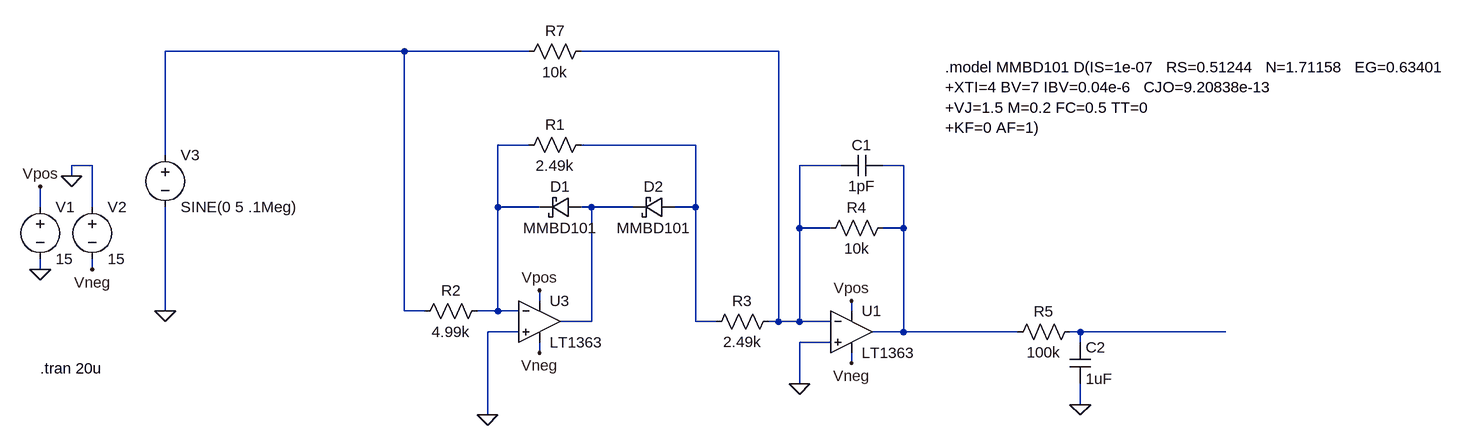
[diagram p0: schematic full wave rectifer LT6275.asc]
full wave rectifer LT6275.asc, the LTspice schematic file:
Version 4
SHEET 1 1204 916
WIRE -512 128 -880 128
WIRE -320 128 -512 128
WIRE 64 128 -240 128
WIRE -320 272 -368 272
WIRE -64 272 -240 272
WIRE -880 288 -880 128
WIRE -992 304 -1024 304
WIRE 160 304 96 304
WIRE 256 304 224 304
WIRE -1024 320 -1024 304
WIRE -1072 368 -1072 336
WIRE -992 368 -992 304
WIRE -368 368 -368 272
WIRE -304 368 -368 368
WIRE -224 368 -240 368
WIRE -160 368 -224 368
WIRE -64 368 -64 272
WIRE -64 368 -96 368
WIRE 96 400 96 304
WIRE 144 400 96 400
WIRE 256 400 256 304
WIRE 256 400 224 400
WIRE -1072 464 -1072 448
WIRE -992 464 -992 448
WIRE -304 512 -304 496
WIRE -880 528 -880 368
WIRE -512 528 -512 128
WIRE -480 528 -512 528
WIRE -368 528 -368 368
WIRE -368 528 -400 528
WIRE -336 528 -368 528
WIRE 176 528 176 512
WIRE -224 544 -224 368
WIRE -224 544 -272 544
WIRE -64 544 -64 368
WIRE -32 544 -64 544
WIRE 64 544 64 128
WIRE 64 544 48 544
WIRE 96 544 96 400
WIRE 96 544 64 544
WIRE 144 544 96 544
WIRE -336 560 -384 560
WIRE 256 560 256 400
WIRE 256 560 208 560
WIRE 432 560 256 560
WIRE 528 560 512 560
WIRE 752 560 528 560
WIRE 144 576 96 576
WIRE 528 576 528 560
WIRE -304 592 -304 576
WIRE 176 608 176 592
WIRE 96 640 96 576
WIRE 528 672 528 640
WIRE -384 688 -384 560
FLAG -1072 464 0
FLAG -1072 336 Vpos
FLAG -1024 320 0
FLAG -992 464 Vneg
FLAG -880 528 0
FLAG -384 688 0
FLAG 96 640 0
FLAG 528 672 0
FLAG -304 496 Vpos
FLAG -304 592 Vneg
FLAG 176 512 Vpos
FLAG 176 608 Vneg
SYMBOL voltage -1072 352 R0
WINDOW 123 0 0 Left 2
WINDOW 39 0 0 Left 2
SYMATTR InstName V1
SYMATTR Value 15
SYMBOL voltage -992 352 R0
WINDOW 123 0 0 Left 2
WINDOW 39 0 0 Left 2
SYMATTR InstName V2
SYMATTR Value 15
SYMBOL res -336 288 R270
WINDOW 0 32 56 VTop 2
WINDOW 3 0 56 VBottom 2
SYMATTR InstName R1
SYMATTR Value 2.49k
SYMBOL res -496 544 R270
WINDOW 0 32 56 VTop 2
WINDOW 3 0 56 VBottom 2
SYMATTR InstName R2
SYMATTR Value 4.99k
SYMBOL res 64 528 R90
WINDOW 0 0 56 VBottom 2
WINDOW 3 32 56 VTop 2
SYMATTR InstName R3
SYMATTR Value 2.49k
SYMBOL res 128 416 R270
WINDOW 0 32 56 VTop 2
WINDOW 3 0 56 VBottom 2
SYMATTR InstName R4
SYMATTR Value 10k
SYMBOL res -336 144 R270
WINDOW 0 32 56 VTop 2
WINDOW 3 0 56 VBottom 2
SYMATTR InstName R7
SYMATTR Value 10k
SYMBOL cap 224 288 R90
WINDOW 0 0 32 VBottom 2
WINDOW 3 32 32 VTop 2
SYMATTR InstName C1
SYMATTR Value 1pF
SYMATTR SpiceLine V=10 Irms=10.541 Rser=0.004 Lser=0 mfg="KEMET" pn="C0603C105K8PAC" type="X5R"
SYMBOL cap 512 576 R0
SYMATTR InstName C2
SYMATTR Value 1uF
SYMATTR SpiceLine V=10 Irms=0 Rser=0.002 Lser=0 mfg="TDK" pn="C2012X5RIA225K" type="X5R"
SYMBOL res 416 576 R270
WINDOW 0 32 56 VTop 2
WINDOW 3 0 56 VBottom 2
SYMATTR InstName R5
SYMATTR Value 100k
SYMATTR SpiceLine tol=1 pwr=0.1
SYMBOL voltage -880 272 R0
WINDOW 123 0 0 Left 2
WINDOW 39 0 0 Left 2
SYMATTR InstName V3
SYMATTR Value SINE(0 5 .1Meg)
SYMBOL Opamps\\LT1363 -304 480 R0
SYMATTR InstName U3
SYMBOL Opamps\\LT1363 176 496 R0
SYMATTR InstName U1
SYMBOL schottky -240 352 R90
WINDOW 0 0 32 VBottom 2
WINDOW 3 32 32 VTop 2
SYMATTR InstName D1
SYMATTR Value MMBD101
SYMATTR Description Diode
SYMATTR Type diode
SYMBOL schottky -96 352 R90
WINDOW 0 0 32 VBottom 2
WINDOW 3 32 32 VTop 2
SYMATTR InstName D2
SYMATTR Value MMBD101
SYMATTR Description Diode
SYMATTR Type diode
TEXT -1072 616 Left 2 !.tran 20u
TEXT 320 152 Left 2 !.model MMBD101 D(IS=1e-07   RS=0.51244   N=1.71158   EG=0.63401\n+XTI=4 BV=7 IBV=0.04e-6   CJO=9.20838e-13\n+VJ=1.5 M=0.2 FC=0.5 TT=0\n+KF=0 AF=1)

The netlist it stands for:
* full wave rectifer LT6275.asc
V1 Vpos 0 15
V2 0 Vneg 15
R1 N003 N004 2.49k
R2 N001 N003 4.99k
R3 N002 N004 2.49k
R4 N002 N005 10k
R7 N001 N002 10k
C1 N005 N002 1pF V=10 Irms=10.541 Rser=0.004 Lser=0 mfg="KEMET" pn="C0603C105K8PAC" type="X5R"
C2 N007 0 1uF V=10 Irms=0 Rser=0.002 Lser=0 mfg="TDK" pn="C2012X5RIA225K" type="X5R"
R5 N005 N007 100k tol=1 pwr=0.1
V3 N001 0 SINE(0 5 .1Meg)
XU3 0 N003 Vpos Vneg N006 LT1363  ; pins In+ In- V+ V- OUT
XU1 0 N002 Vpos Vneg N005 LT1363  ; pins In+ In- V+ V- OUT
D1 N006 N003 MMBD101
D2 N004 N006 MMBD101
.model D D
.lib standard.dio
.tran 20u
.model MMBD101 D(IS=1e-07   RS=0.51244   N=1.71158   EG=0.63401
+XTI=4 BV=7 IBV=0.04e-6   CJO=9.20838e-13
+VJ=1.5 M=0.2 FC=0.5 TT=0
+KF=0 AF=1)
.lib LT1363.sub
.backanno
.end